# Altium schematic sheet Current_Limit.SchDoc
size A4; SheetNumber: 7; SheetTotal: 8
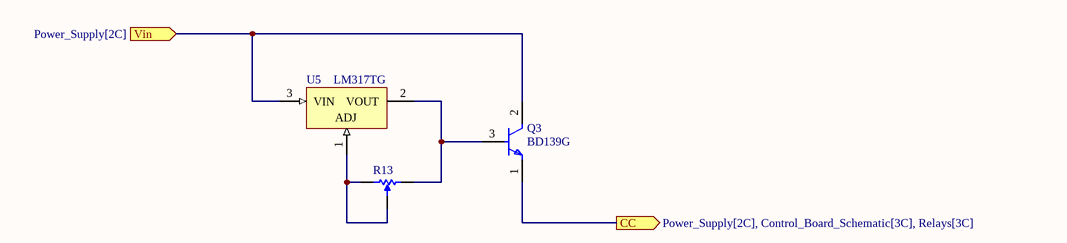
[diagram p0: Current_Limit.SchDoc]

## Parts
Q3  BD139G  [FP-77-09-MFG]
R13  3296W-1-102LF  [BOUR-3296W-1-3]  (value not drawn)
U5  LM317TG  [ONSC-TO-220-3-221AB-01]

## Ports
CC (out, see Power_Supply[2C], Control_Board_Schematic[3C], Relays[3C]), Vin (in, see Power_Supply[2C])

## Nets
CC: Q3.1(E) ; port CC
Vin: Q3.2(C) U5.3(VIN) ; port Vin
NetQ3_3: Q3.3(B) R13.2(B) U5.2(VOUT)
NetR13_1: R13.1(A) R13.3(TAP) U5.1(ADJ)

## Library data of the parts
Q3 = CMP-013-00035-1: 1.5 A, 80 V NPN Power Bipolar Junction Transistor. ONSSPCTRNSTLT1T0R;; Pins: 3; Max Operating Temperature: 150°C; Case/Package: TO-225; Min Operating Temperature: -55°C; Mounting Technology: Through Hole
R13 = CMP-009-00037-2: Square Trimpot(R) Trimming Potentiometer, 1000 Ohm, -55 to 125 degC, 3-Pin THD, RoHS, Tube; Manufacturer: Bourns; Power: 500mW; Tolerance: 10%; Voltage Rating: 300V; Resistance: 1k; Datasheet Version: May-16; Min Operating Temperature: -55°C; Max Operating Temperature: 150°C; Composition: Potentiometer; Package Description: 3-Pin Through Hole Device, Body 9.53 x 4.83 mm, Pitch 2.54 mm; Manufacturer URL: http://www.bourns.com/; Package Reference: 3296W-1-3; RoHS Compliant: True; Case/Package: 3296W-1-3; Packaging: Rail/Tube; Mounting Technology: TH; Package Quantity: 50; Datasheet URL: http://www.bourns.com/docs/Product-Datasheets/3296.pdf
U5 = CMP-019-00023-3: Adjustable Output, Positive Voltage Regulator, 1.5 A, 0 to 125 degC, 3-Pin TO-220 (221AB-01), Pb-Free, Rail; Manufacturer: ON Semiconductor; Outputs: 1; Max Input Voltage: 40V; Min Input Voltage: 4.2V; Output Current: 1.5A; Output Voltage: 1.2V; Package Version: Rev. A, 11/2010; Mounting Technology: TH; Case/Package: TO-220; Package Description: 3-Pin Flange Mount, Vertical Straight Lead, Body 9.97 x 4.445 mm, Pitch 2.54 mm; Package Reference: TO-220-3-221AB-01; Manufacturer URL: http://www.onsemi.com/; Package Quantity: 50; Datasheet Version: Rev. 14, 01/2016; Max Ouput Current: 1.5A; Min Operating Temperature: 0°C; Packaging: Rail/Tube; Datasheet URL: http://www.onsemi.com/pub_link/Collateral/LM317-D.PDF; Max Operating Temperature: 125°C; RoHS Compliant: True; Pins: 3